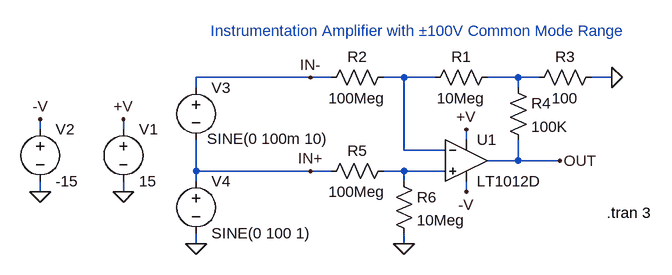
[diagram p0: schematic 1012D.asc]
1012D.asc, the LTspice schematic file:
Version 4
SHEET 1 896 680
WIRE -48 112 -224 112
WIRE -16 112 -48 112
WIRE 96 112 64 112
WIRE 144 112 96 112
WIRE 272 112 224 112
WIRE 304 112 272 112
WIRE 416 112 384 112
WIRE -224 128 -224 112
WIRE 272 128 272 112
WIRE -464 192 -464 176
WIRE -336 192 -336 176
WIRE 192 208 192 192
WIRE 96 224 96 112
WIRE 160 224 96 224
WIRE 272 240 272 208
WIRE 272 240 224 240
WIRE 336 240 272 240
WIRE -224 256 -224 208
WIRE -48 256 -224 256
WIRE -16 256 -48 256
WIRE 96 256 64 256
WIRE 160 256 96 256
WIRE -224 272 -224 256
WIRE 96 272 96 256
WIRE -464 288 -464 272
WIRE -336 288 -336 272
WIRE 192 288 192 272
WIRE -224 368 -224 352
WIRE 96 368 96 352
FLAG -336 288 0
FLAG 192 192 +V
FLAG -336 176 +V
FLAG 192 288 -V
FLAG -464 288 0
FLAG -464 176 -V
FLAG -224 368 0
FLAG 416 112 0
FLAG 96 368 0
FLAG 336 240 OUT
FLAG -48 256 IN+
FLAG -48 112 IN-
SYMBOL voltage -336 176 R0
SYMATTR InstName V1
SYMATTR Value 15
SYMBOL voltage -464 176 R0
SYMATTR InstName V2
SYMATTR Value -15
SYMBOL res 240 96 R90
WINDOW 0 0 56 VBottom 0
WINDOW 3 32 56 VTop 0
SYMATTR InstName R1
SYMATTR Value 10Meg
SYMBOL res 80 96 R90
WINDOW 0 0 56 VBottom 0
WINDOW 3 32 56 VTop 0
SYMATTR InstName R2
SYMATTR Value 100Meg
SYMBOL voltage -224 112 R0
WINDOW 3 17 94 Left 0
SYMATTR InstName V3
SYMATTR Value SINE(0 100m 10)
SYMBOL res 400 96 R90
WINDOW 0 0 56 VBottom 0
WINDOW 3 32 56 VTop 0
SYMATTR InstName R3
SYMATTR Value 100
SYMBOL res 256 112 R0
SYMATTR InstName R4
SYMATTR Value 100K
SYMBOL res 80 240 R90
WINDOW 0 0 56 VBottom 0
WINDOW 3 32 56 VTop 0
SYMATTR InstName R5
SYMATTR Value 100Meg
SYMBOL res 80 256 R0
SYMATTR InstName R6
SYMATTR Value 10Meg
SYMBOL voltage -224 256 R0
SYMATTR InstName V4
SYMATTR Value SINE(0 100 1)
SYMBOL opamps\\LT1012D 192 176 R0
SYMATTR InstName U1
TEXT 408 320 Left 0 !.tran 3
TEXT 120 56 Bottom 0 ;Instrumentation Amplifier with ±100V Common Mode Range

The netlist it stands for:
* 1012D.asc
V1 +V 0 15
V2 -V 0 -15
R1 N002 N001 10Meg
R2 N001 IN- 100Meg
V3 IN- IN+ SINE(0 100m 10)
R3 0 N002 100
R4 N002 OUT 100K
R5 N003 IN+ 100Meg
R6 N003 0 10Meg
V4 IN+ 0 SINE(0 100 1)
XU1 N003 N001 +V -V OUT LT1012D  ; pins In+ In- V+ V- OUT
.tran 3
* Instrumentation Amplifier with ±100V Common Mode Range
.backanno
.end